# Altium schematic sheet AC_Measure.SchDoc
size A2
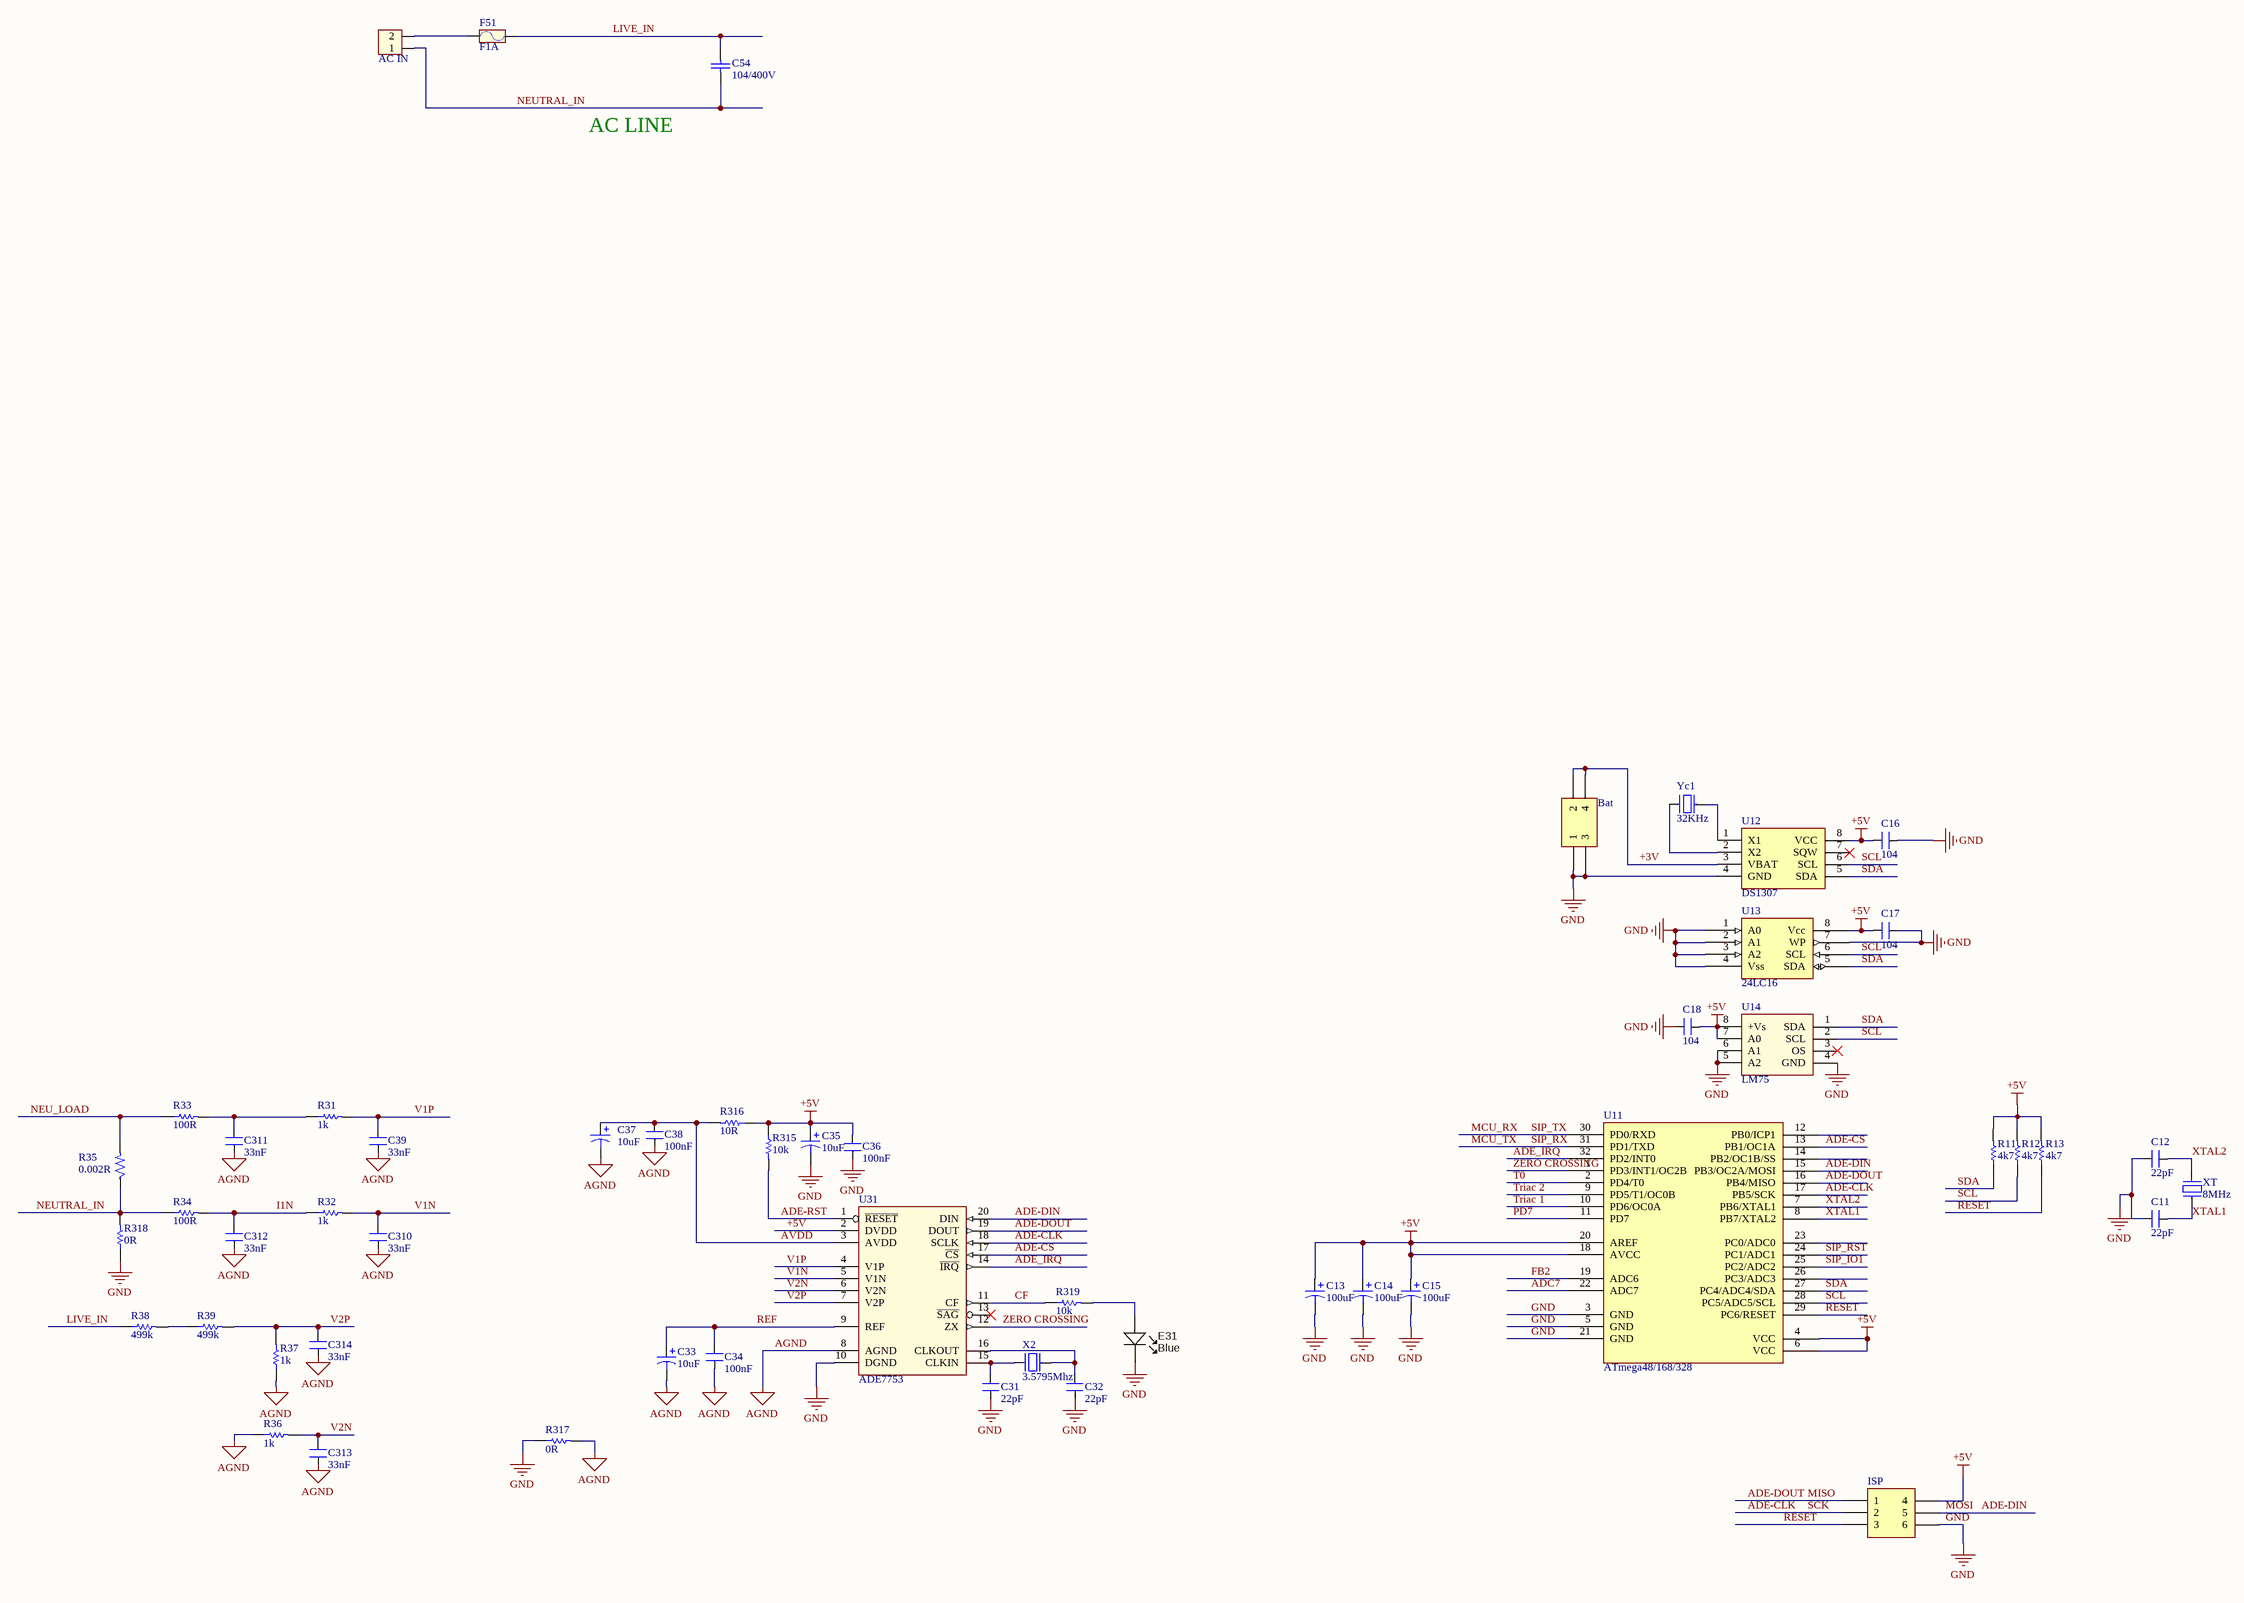
[diagram p0: AC_Measure.SchDoc]

## Parts
AC_IN  JP2  [CON2]  (value not drawn)
Bat  Header 2X2  [HDR2X2]  (value not drawn)
C11  value 22pF  [CAPC1608N]  (hidden comment: CAP NP)
C12  value 22pF  [CAPC1608N]  (hidden comment: CAP NP)
C13  value 100uF  [CAPC2012N_F]  (hidden comment: Cap)
C14  value 100uF  [CAPC2012N_F]  (hidden comment: Cap)
C15  value 100uF  [CAPC2012N_F]  (hidden comment: Cap)
C16  value 104  [CAPC2012N_F]  (hidden comment: CAP NP)
C17  value 104  [CAPC2012N_F]  (hidden comment: CAP NP)
C18  value 104  [CAPC2012N_F]  (hidden comment: CAP NP)
C31  value 22pF  [CAPC1608N]  (hidden comment: CAP NP)
C32  value 22pF  [CAPC1608N]  (hidden comment: CAP NP)
C33  value 10uF  [CAPC2012N_F]  (hidden comment: Cap)
C34  value 100nF  [CAPC1608N]  (hidden comment: CAP NP)
C35  value 10uF  [CAPC2012N_F]  (hidden comment: Cap)
C36  value 100nF  [CAPC1608N]  (hidden comment: CAP NP)
C37  value 10uF  [CAPC2012N_F]  (hidden comment: Cap)
C38  value 100nF  [CAPC1608N]  (hidden comment: CAP NP)
C39  value 33nF  [CAPC1608N]  (hidden comment: CAP NP)
C54  104/400V  [CN3]
C310  value 33nF  [CAPC1608N]  (hidden comment: CAP NP)
C311  value 33nF  [CAPC1608N]  (hidden comment: CAP NP)
C312  value 33nF  [CAPC1608N]  (hidden comment: CAP NP)
C313  value 33nF  [CAPC1608N]  (hidden comment: CAP NP)
C314  value 33nF  [CAPC1608N]  (hidden comment: CAP NP)
E31  Blue  [LED-0805-K]
F51  F1A  [FUSE2]
ISP  Header 3X2A  [HDR2X3_CEN]  (value not drawn)
R11  value 4k7  [RESC1608N_ZERO]  (hidden comment: Res)
R12  value 4k7  [RESC1608N_ZERO]  (hidden comment: Res)
R13  value 4k7  [RESC1608N_ZERO]  (hidden comment: Res)
R31  value 1k  [RESC1608N_ZERO]  (hidden comment: Res)
R32  value 1k  [RESC1608N_ZERO]  (hidden comment: Res)
R33  value 100R  [RESC1608N_ZERO]  (hidden comment: Res)
R34  value 100R  [RESC1608N_ZERO]  (hidden comment: Res)
R35  0.002R  [RESC6332N]
R36  value 1k  [RESC1608N_ZERO]  (hidden comment: Res)
R37  value 1k  [RESC1608N_ZERO]  (hidden comment: Res)
R38  value 499k  [RESC2012N_F]  (hidden comment: Res)
R39  value 499k  [RESC2012N_F]  (hidden comment: Res)
R315  value 10k  [RESC1608N_ZERO]  (hidden comment: Res)
R316  value 10R  [RESC2012N_F]  (hidden comment: Res)
R317  value 0R  [RESC2012N_F]  (hidden comment: Res)
R318  value 0R  [RESC2012N_F]  (hidden comment: Res)
R319  value 10k  [RESC1608N_ZERO]  (hidden comment: Res)
U11  ATmega48/168/328  [32A_N]
U12  DS1307  [SOIC-8]
U13  24LC16  [SOIC-8]
U14  LM75  [SOIC-8]
U31  ADE7753  [TSSOP-20]
X2  3.5795Mhz  [XT2]
XT  8MHz  [XT2]
Yc1  32KHz  [XTminiv2]

## Nets
+5V: C13.1 C14.1 C15.1 C16.1 C17.1 C18.2 C35.1 C36.2 ISP.4 R11.2 R12.2 R13.2 R315.1 R316.1 U11.4(VCC) U11.6(VCC) U11.18(AVCC) U11.20(AREF) U12.8(VCC) U13.8(Vcc) U14.7(A0) U14.8(+Vs) U31.2(DVDD)
AGND: C33.2 C34.1 C37.2 C38.1 C39.1 C310.1 C311.1 C312.1 C313.1 C314.1 R36.1 R37.1 R317.2 U31.8(AGND)
GND: Bat.1 Bat.3 C11.2 C12.2 C13.2 C14.2 C15.2 C16.2 C17.2 C18.1 C31.1 C32.1 C35.2 C36.1 E31.K ISP.6 R317.1 R318.1 U11.3(GND) U11.5(GND) U11.21(GND) U12.4(GND) U13.1(A0) U13.2(A1) U13.3(A2) U13.4(Vss) U13.7(WP) U14.4(GND) U14.5(A2) U14.6(A1) U31.10(DGND)
+3V: Bat.2 Bat.4 U12.3(VBAT)
ADC7: U11.22(ADC7)
ADE-CLK: ISP.2 U11.17(PB5/SCK) U31.18(SCLK)  [also labelled SCK]
ADE-CS: U11.13(PB1/OC1A) U31.17(~{CS})
ADE-DIN: ISP.5 U11.15(PB3/OC2A/MOSI) U31.20(DIN)  [also labelled MOSI]
ADE-DOUT: ISP.1 U11.16(PB4/MISO) U31.19(DOUT)  [also labelled MISO]
ADE-RST: R315.2 U31.1(~{RESET})
ADE_IRQ: U11.32(PD2/INT0) U31.14(~{IRQ})
AVDD: C37.1 C38.2 R316.2 U31.3(AVDD)
CF: R319.1 U31.11(CF)
FB2: U11.19(ADC6)
I1N: C312.2 R32.1 R34.2
LIVE_IN: C54.2 F51.2 R38.1
MCU_RX: U11.30(PD0/RXD)  [also labelled SIP_TX]
MCU_TX: U11.31(PD1/TXD)  [also labelled SIP_RX]
NEU_LOAD: R33.1 R35.2
NEUTRAL_IN: AC_IN.1 C54.1 R34.1 R35.1 R318.2
PD7: U11.11(PD7)
REF: C33.1 C34.2 U31.9(REF)
RESET: ISP.3 R13.1 U11.29(PC6/RESET)
SCL: R12.1 U11.28(PC5/ADC5/SCL) U12.6(SCL) U13.6(SCL) U14.2(SCL)
SDA: R11.1 U11.27(PC4/ADC4/SDA) U12.5(SDA) U13.5(SDA) U14.1(SDA)
SIP_IO1: U11.25(PC2/ADC2)
SIP_RST: U11.24(PC1/ADC1)
T0: U11.2(PD4/T0)
Triac 1: U11.10(PD6/OC0A)
Triac 2: U11.9(PD5/T1/OC0B)
V1N: C310.2 R32.2 U31.5(V1N)
V1P: C39.2 R31.2 U31.4(V1P)
V2N: C313.2 R36.2 U31.6(V2N)
V2P: C314.2 R37.2 R39.2 U31.7(V2P)
XTAL1: C11.1 U11.8(PB7/XTAL2) XT.1
XTAL2: C12.1 U11.7(PB6/XTAL1) XT.2
ZERO CROSSING: U11.1(PD3/INT1/OC2B) U31.12(ZX)
NetAC_IN_2: AC_IN.2 F51.1
NetC31_2: C31.2 U31.15(CLKIN) X2.2
NetC32_2: C32.2 U31.16(CLKOUT) X2.1
NetC311_2: C311.2 R31.1 R33.2
NetE31_A: E31.A R319.2
NetR38_2: R38.2 R39.1
NetU12_1: U12.1(X1) Yc1.1
NetU12_2: U12.2(X2) Yc1.2

Not connected (* = marked no-connect by the designer): U11 12(PB0/ICP1) 14(PB2/OC1B/SS) 23(PC0/ADC0) 26(PC3/ADC3); U12 7(SQW)*; U14 3(OS)*; U31 13(~{SAG})*

## Notes on the sheet
- AC LINE
- Designer:
- Day:
- HUNGND
- Drawing Title:
- Date:
- Drawn by:
- Day
- Approved:
- Time:
- Page Title:
- Document Number:
- Sheet
- of
- Size: A3
- Rev:
- File:

## Library data of the parts
AC_IN = Con2: Connector 2; Value: Connector 2
Bat = Header 2X2: Header, 2-Pin, Dual row; LatestRevisionDate: 17-Jul-2002; LatestRevisionNote: Re-released for DXP Platform.; Publisher: Altium Limited
C54 = Cap: Capacitor; Value: 100pF; Published: 8-Jun-2000; LatestRevisionDate: 17-Jul-2002; LatestRevisionNote: Re-released for DXP Platform.; PackageReference: RAD-0.3; Publisher: Altium Limited; PackageDescription: Radial Cap, Thru-Hole; 2 Leads; 0.3 in Pin Spacing
E31 = LED_SMD_Blue_0805_100mcd: LED 0805 SMD Blue 100mcd 470nm; Manufacturer 1: Ligitek; Manufacturer Part Number 1: LG-170DBKZ-CT; Ratings: 100 mcd; 470 nm; Package / Case: 0805; Material: InGaN/GaN; Value: Blue; Color: Blue
F51 = Fuse: Designed by: VanDungEvn; Value: Fuse
ISP = Header 3X2A: Header, 3-Pin, Dual row; LatestRevisionDate: 17-Jul-2002; LatestRevisionNote: Re-released for DXP Platform.; Publisher: Altium Limited
R35 = R: Resistor 1/4W; Value: 2512/1W/1%
U12 = DS1307: Real Timer Serial; Value: DS1307
U13 = 24LC04B
U31 = ADE7753: Single-Phase Multifunction Metering IC with di/dt Sensor Interface
X2 Yc1 = XT2: Crystal For all Crystal 2pin.; Value: 4Mhz
XT = Crystal